# EAGLE design hyundai_m (EAGLE 9.6.2)
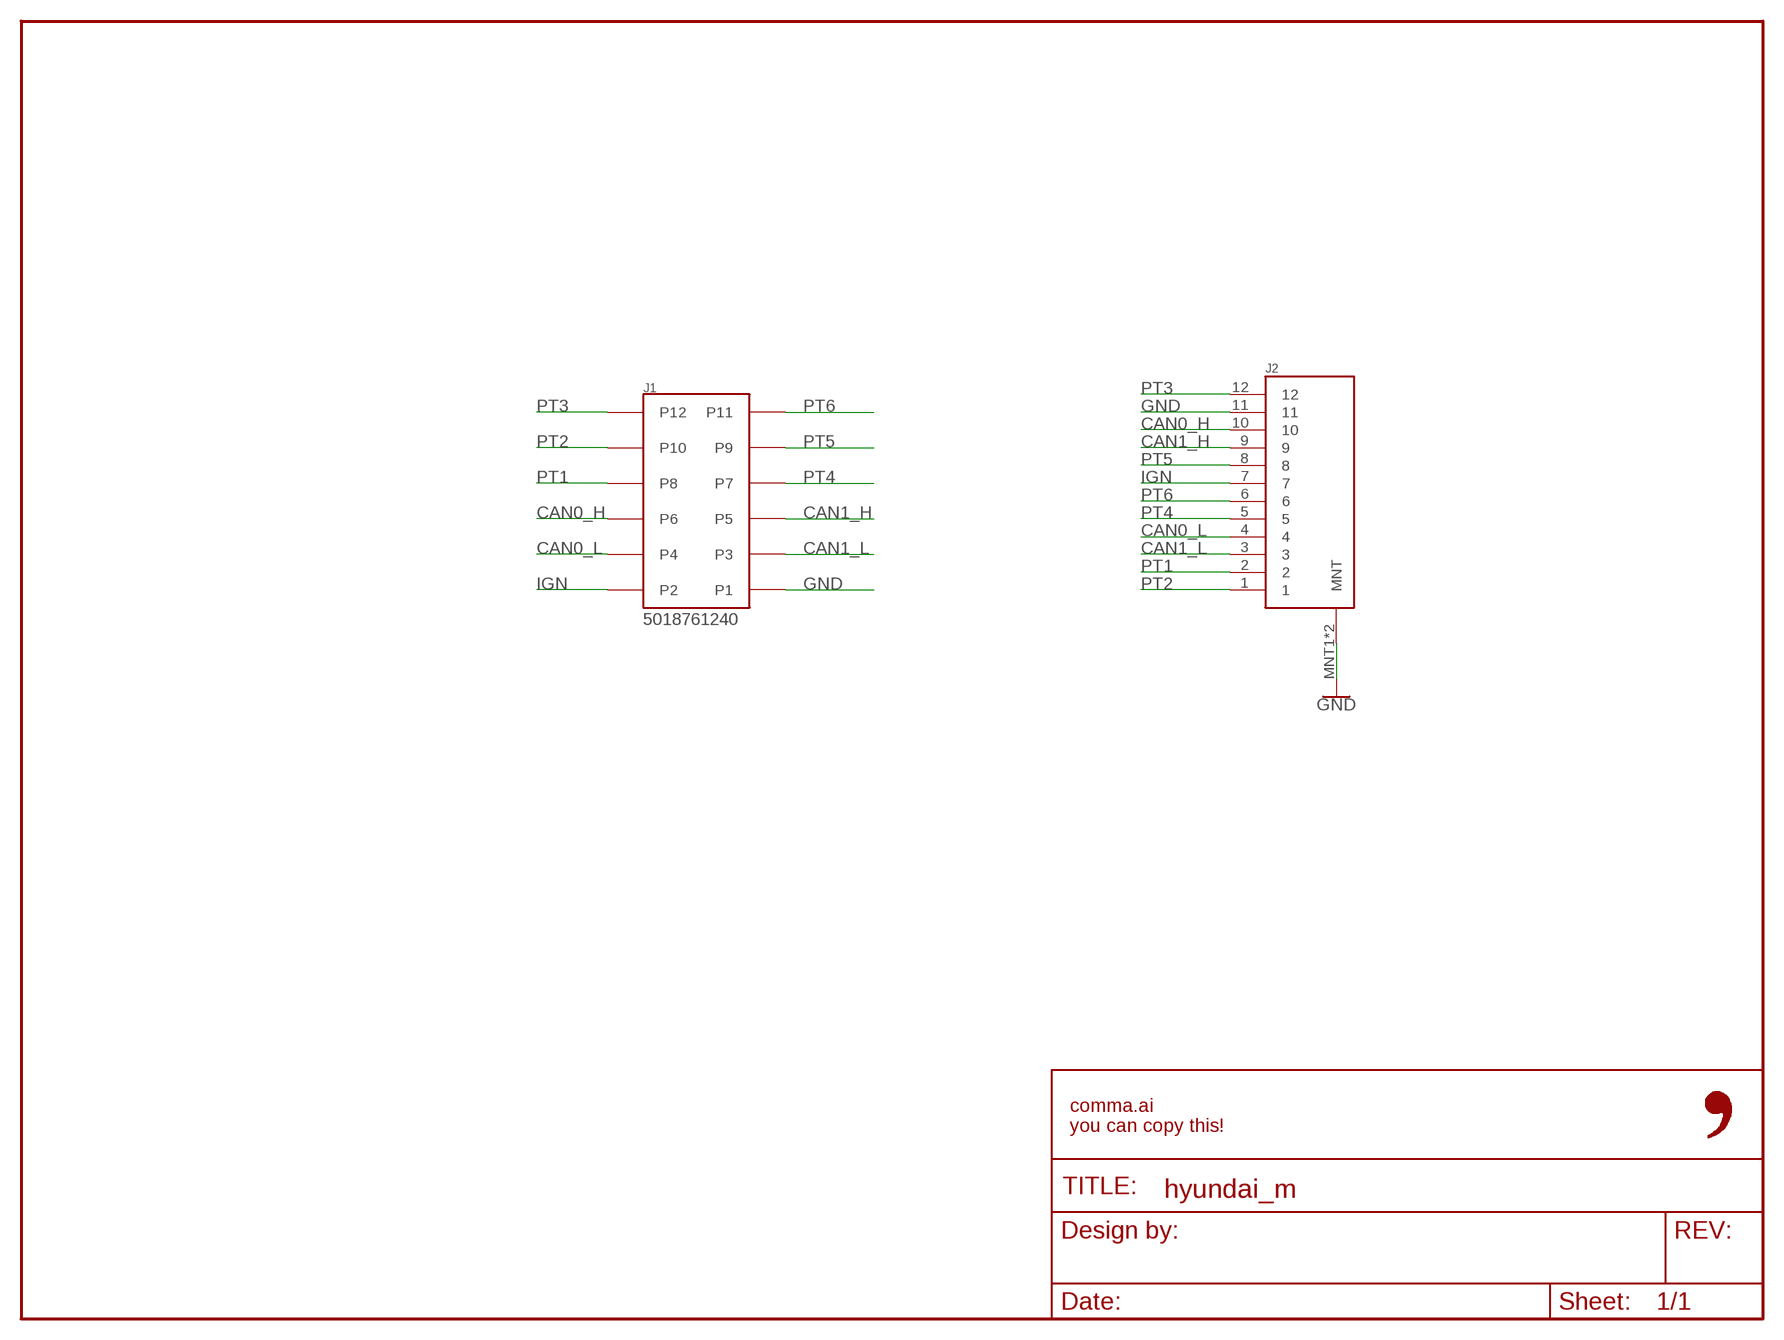
[diagram p0: schematic, sheet 1]

## Parts
FRAME1  FRAME-LETTER-OPENNO_PACKAGE  [DUMMY]
J1  5018761240  [5018761240]
J2  MG646151  [MG646151]

## Nets
CAN0_H: J1.P6 J2.10
CAN0_L: J1.P4 J2.4
CAN1_H: J1.P5 J2.9
CAN1_L: J1.P3 J2.3
GND: J1.P1 J2.11 J2.MNT1(MNT) J2.MNT2(MNT)
IGN: J1.P2 J2.7
PT1: J1.P8 J2.2
PT2: J1.P10 J2.1
PT3: J1.P12 J2.12
PT4: J1.P7 J2.5
PT5: J1.P9 J2.8
PT6: J1.P11 J2.6

## Notes on the sheet
- 5018761240

## Library data of the parts
FRAME1 = comma.ai:FRAME-LETTER-OPEN: Schematic Frame - Letter Standard 8.5x11 US Letter frame; DESIGNER: Nobody; VERSION: v01
J1 = comma.ai:5018761240; CPN: CAI-HARNESS-MOLEX-5018761240
J2 = comma.ai:MG646151; CPN: CAI-HARNESS-KET-MG646086

## Board
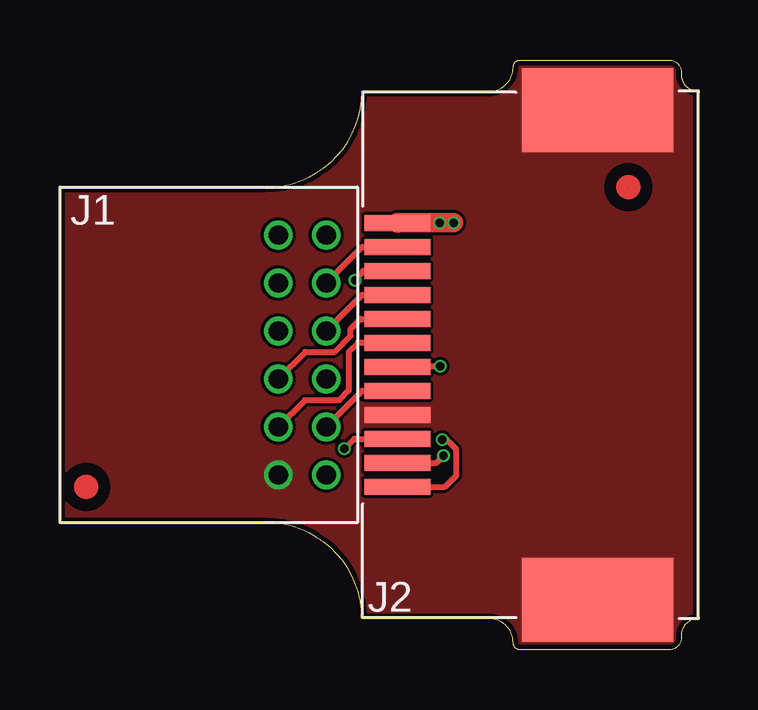
[diagram p1: board, top side]
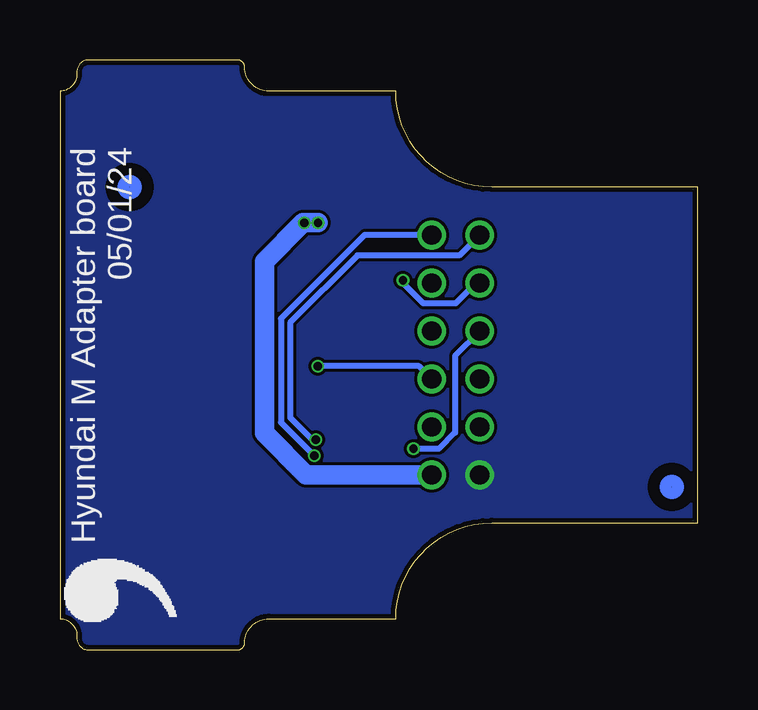
[diagram p2: board, bottom side, seen from below]

Size 26.6 x 24.6 mm. Coordinates in mm from the lower left corner, seen from the top.
Outline: 0,19.3 8.6,19.3 arc90 12.6,23.3 17.9,23.3 arc90 18.9,24.3 arc-90 19.2,24.6 25.4,24.6 arc-90 25.9,24.1 25.9,24 arc90 26.6,23.3 26.6,1.3 arc90 25.9,0.6 25.9,0.5 arc-90 25.4,0 19.2,0 arc-90 18.9,0.3 arc90 17.9,1.3 12.6,1.3 arc90 8.6,5.3 0,5.3 0,19.3
Copper layers (1*16): Top 0.035mm / dielectric 1.5mm / Bottom 0.035mm
Design rules "jlcpcb_2layer": minimum track width 5mil, minimum drill 12mil, track to track 5mil, track to pad 5mil, pad to pad 5mil, via to via 5mil, smd to smd 5mil, copper to edge 8mil, drill to drill 8mil, minimum pad ring 3mil, minimum via ring 3mil, stop-mask expansion 4mm, vias tented up to drill 20mil, thermal gap 10mil

### Footprints (pad centres in the part's own frame; a part is rotated, then mirrored left to right if it is on the bottom)
5018761240 = drill 0.8: P1 5,-1; P2 5,1; P3 3,-1; P4 3,1; P5 1,-1; P6 1,1; P7 -1,-1; P8 -1,1; P9 -3,-1; P10 -3,1; P11 -5,-1; P12 -5,1
MG646151 = smd 0.66 x 2.75: 1 4.5,8.35; 2 2.5,8.35; 3 0.5,8.35; 4 -1.5,8.35; 5 -3.5,8.35; 6 -5.5,8.35; 7 5.5,8.35; 8 3.5,8.35; 9 1.5,8.35; 10 -0.5,8.35; 11 -2.5,8.35; 12 -4.5,8.35 | smd 3.5 x 6.3: MNT1 -10.2,0; MNT2 10.2,0

### Placement (x,y rotation side)
FRAME1  -3.87,47.86 0 top  (outside the outline)
J1  10.1,12.3 270 top
J2  22.42,12.3 90 top
U$1  [LOGO]  21.43,0.51 90 bottom
U$2  [FIDUCIAL]  23.7,19.3 0 top
U$3  [FIDUCIAL]  1.1,6.8 0 top

### Tracks (layer width: path | path; a pad name or v marks a point on that pad's centre or on a via)
CAN0_H  (via drill 0.35)
  Top 0.254: J2.10 14.1,11.83 v15.85,11.83
  Bottom 0.254: J1.P6 11.63,11.83 v15.85,11.83
CAN0_L
  Top 0.254: J1.P4 12.6,10.8 J2.4
CAN1_H
  Top 0.254: J1.P5 10.23,12.43 11.44,12.43 12.12,13.11 12.12,13.39 12.53,13.8 J2.9
CAN1_L
  Top 0.254: J2.3 12.42,12.8 12.04,12.42 12.04,10.81 11.64,10.41 10.21,10.41 J1.P3
GND
  pour Top (no thermals): -0.9,25.3 28.1,25.3 28.1,-0.7 -0.9,-0.7
  pour Bottom (no thermals): -1.9,26.3 29.1,26.3 29.1,-1.7 -1.9,-1.7
IGN  (via drill 0.35)
  Top 0.813: J2.7 v16.41,17.81
  Bottom 0.813: J1.P2 16.33,7.3 18.08,9.05 18.08,16.2 16.47,17.81 v16.41,17.81 v15.84,17.81
PT1
  Top 0.254: J1.P8 12.6,14.8 J2.2
PT2
  Top 0.254: J1.P10 12.6,16.8 J2.1
PT3  (via drill 0.35)
  Top 0.254: J2.12 15.69,7.8 v15.99,8.1
  Bottom 0.254: J1.P12 13.9,17.3 17.38,13.82 17.38,9.49 v15.99,8.1
PT4  (via drill 0.35)
  Top 0.254: v11.86,8.39 12.27,8.8 J2.5
  Bottom 0.254: J1.P7 10.13,12.27 10.13,9.06 10.8,8.39 v11.86,8.39
PT5  (via drill 0.35)
  Top 0.254: v12.3,15.41 12.3,15.45 12.65,15.8 J2.8
  Bottom 0.254: J1.P9 9.25,15.3 10.1,14.45 11.45,14.45 12.3,15.29 v12.3,15.41
PT6  (via drill 0.35)
  Top 0.254: J2.6 16.05,6.8 16.53,7.28 16.53,8.35 16.11,8.77 v15.93,8.77
  Bottom 0.254: J1.P11 9.95,16.45 14.2,16.45 17,13.65 17,9.69 16.09,8.77 v15.93,8.77

### Text on the board
bNames: Hyundai M Adapter board / 05/01/24